# EAGLE design DevBoard (EAGLE 9.3.2)
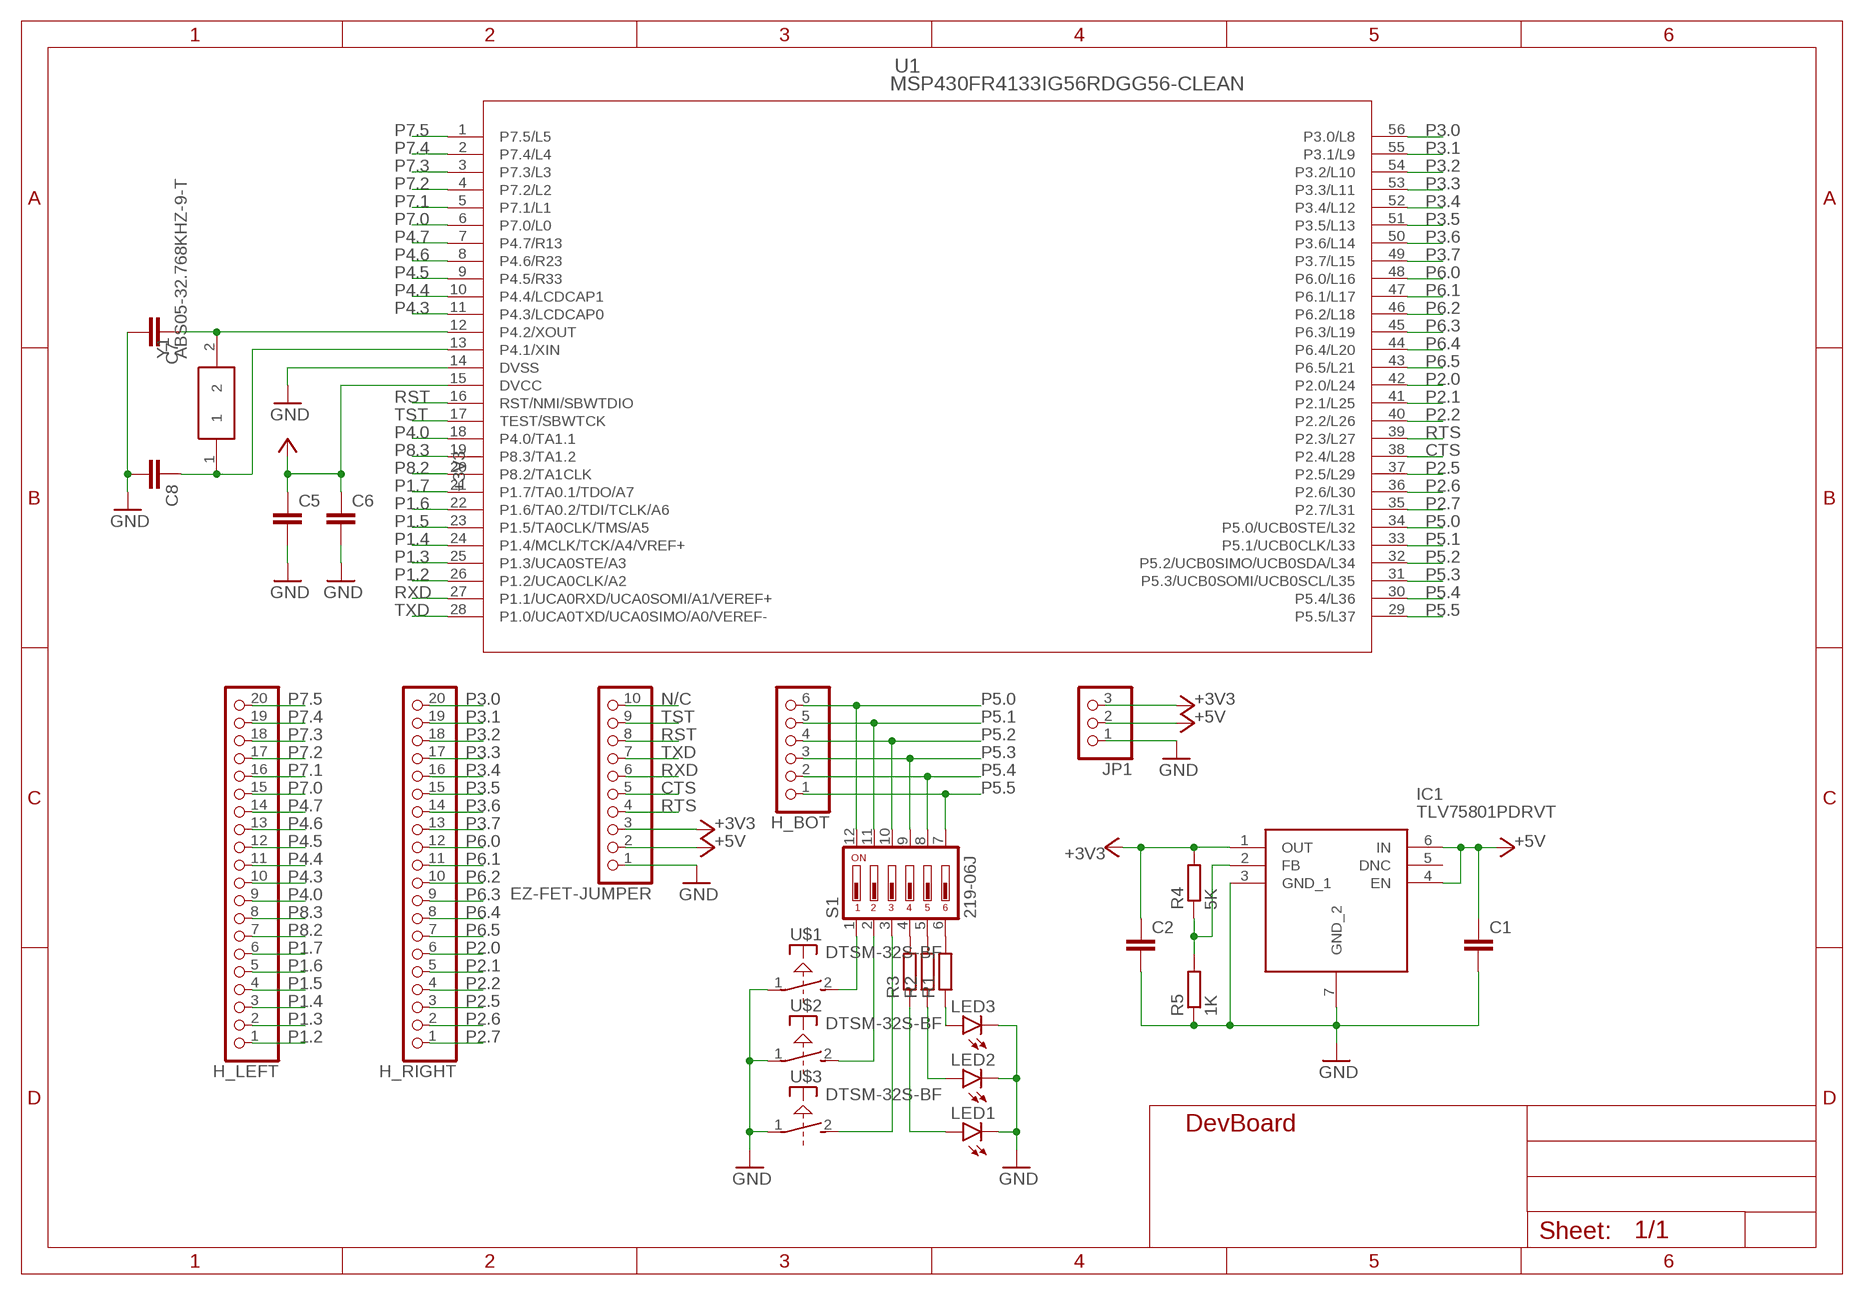
[diagram p0: schematic, sheet 1]

## Parts
C1  C-EUC0805K  [C0805K]
C2  C-EUC0805K  [C0805K]
C5  C-EUC0805K  [C0805K]
C6  C-EUC0805K  [C0805K]
C7  C-EUC0805K  [C0805K]
C8  C-EUC0805K  [C0805K]
EZ-FET-JUMPER  PINHD-1X10  [1X10]
H_BOT  PINHD-1X6  [1X06]
H_LEFT  PINHD-1X20  [1X20]
H_RIGHT  PINHD-1X20  [1X20]
IC1  TLV75801PDRVT  [SON65P200X200X80-7N]
JP1  PINHD-1X3  [1X03]
LED1  LEDCHIP-LED0805  [CHIP-LED0805]
LED2  LEDCHIP-LED0805  [CHIP-LED0805]
LED3  LEDCHIP-LED0805  [CHIP-LED0805]
R1  R-EU_R0805  [R0805]
R2  R-EU_R0805  [R0805]
R3  R-EU_R0805  [R0805]
R4  5K  R-EU_R0805  [R0805]
R5  1K  R-EU_R0805  [R0805]
S1  219-06J  [CTS-219-06J]
U1  MSP430FR4133IG56RDGG56-CLEAN  [DGG56_CLEAN]
U$1  DTSM-32S-BF  [DTSM32SBF]
U$2  DTSM-32S-BF  [DTSM32SBF]
U$3  DTSM-32S-BF  [DTSM32SBF]
Y1  ABS05-32.768KHZ-9-T  [ABS05]

## Nets
+3V3: C2.1 C5.1 C6.1 EZ-FET-JUMPER.3 IC1.1(OUT) JP1.3 R4.2 U1.15(DVCC)
+5V: C1.1 EZ-FET-JUMPER.2 IC1.4(EN) IC1.6(IN) JP1.2
CTS: EZ-FET-JUMPER.5 U1.38(P2.4/L28)
GND: C1.2 C2.2 C5.2 C6.2 C7.2 C8.2 EZ-FET-JUMPER.1 IC1.3(GND_1) IC1.7(GND_2) JP1.1 LED1.C LED2.C LED3.C R5.1 U1.14(DVSS) U$1.1(P) U$2.1(P) U$3.1(P)
N$1: R1.2 S1.6
N$2: R2.2 S1.5
N$3: R3.2 S1.4
N$4: LED1.A R3.1
N$5: LED2.A R2.1
N$6: LED3.A R1.1
N$7: S1.1 U$1.2(S)
N$8: S1.2 U$2.2(S)
N$9: S1.3 U$3.2(S)
N$12: IC1.2(FB) R4.1 R5.2
N$14: C8.1 U1.13(P4.1/XIN) Y1.1
N$16: C7.1 U1.12(P4.2/XOUT) Y1.2
N/C: EZ-FET-JUMPER.10
P1.2: H_LEFT.1 U1.26(P1.2/UCA0CLK/A2)
P1.3: H_LEFT.2 U1.25(P1.3/UCA0STE/A3)
P1.4: H_LEFT.3 U1.24(P1.4/MCLK/TCK/A4/VREF+)
P1.5: H_LEFT.4 U1.23(P1.5/TA0CLK/TMS/A5)
P1.6: H_LEFT.5 U1.22(P1.6/TA0.2/TDI/TCLK/A6)
P1.7: H_LEFT.6 U1.21(P1.7/TA0.1/TDO/A7)
P2.0: H_RIGHT.6 U1.42(P2.0/L24)
P2.1: H_RIGHT.5 U1.41(P2.1/L25)
P2.2: H_RIGHT.4 U1.40(P2.2/L26)
P2.5: H_RIGHT.3 U1.37(P2.5/L29)
P2.6: H_RIGHT.2 U1.36(P2.6/L30)
P2.7: H_RIGHT.1 U1.35(P2.7/L31)
P3.0: H_RIGHT.20 U1.56(P3.0/L8)
P3.1: H_RIGHT.19 U1.55(P3.1/L9)
P3.2: H_RIGHT.18 U1.54(P3.2/L10)
P3.3: H_RIGHT.17 U1.53(P3.3/L11)
P3.4: H_RIGHT.16 U1.52(P3.4/L12)
P3.5: H_RIGHT.15 U1.51(P3.5/L13)
P3.6: H_RIGHT.14 U1.50(P3.6/L14)
P3.7: H_RIGHT.13 U1.49(P3.7/L15)
P4.0: H_LEFT.9 U1.18(P4.0/TA1.1)
P4.3: H_LEFT.10 U1.11(P4.3/LCDCAP0)
P4.4: H_LEFT.11 U1.10(P4.4/LCDCAP1)
P4.5: H_LEFT.12 U1.9(P4.5/R33)
P4.6: H_LEFT.13 U1.8(P4.6/R23)
P4.7: H_LEFT.14 U1.7(P4.7/R13)
P5.0: H_BOT.6 S1.12 U1.34(P5.0/UCB0STE/L32)
P5.1: H_BOT.5 S1.11 U1.33(P5.1/UCB0CLK/L33)
P5.2: H_BOT.4 S1.10 U1.32(P5.2/UCB0SIMO/UCB0SDA/L34)
P5.3: H_BOT.3 S1.9 U1.31(P5.3/UCB0SOMI/UCB0SCL/L35)
P5.4: H_BOT.2 S1.8 U1.30(P5.4/L36)
P5.5: H_BOT.1 S1.7 U1.29(P5.5/L37)
P6.0: H_RIGHT.12 U1.48(P6.0/L16)
P6.1: H_RIGHT.11 U1.47(P6.1/L17)
P6.2: H_RIGHT.10 U1.46(P6.2/L18)
P6.3: H_RIGHT.9 U1.45(P6.3/L19)
P6.4: H_RIGHT.8 U1.44(P6.4/L20)
P6.5: H_RIGHT.7 U1.43(P6.5/L21)
P7.0: H_LEFT.15 U1.6(P7.0/L0)
P7.1: H_LEFT.16 U1.5(P7.1/L1)
P7.2: H_LEFT.17 U1.4(P7.2/L2)
P7.3: H_LEFT.18 U1.3(P7.3/L3)
P7.4: H_LEFT.19 U1.2(P7.4/L4)
P7.5: H_LEFT.20 U1.1(P7.5/L5)
P8.2: H_LEFT.7 U1.20(P8.2/TA1CLK)
P8.3: H_LEFT.8 U1.19(P8.3/TA1.2)
RST: EZ-FET-JUMPER.8 U1.16(RST/NMI/SBWTDIO)
RTS: EZ-FET-JUMPER.4 U1.39(P2.3/L27)
RXD: EZ-FET-JUMPER.6 U1.27(P1.1/UCA0RXD/UCA0SOMI/A1/VEREF+)
TST: EZ-FET-JUMPER.9 U1.17(TEST/SBWTCK)
TXD: EZ-FET-JUMPER.7 U1.28(P1.0/UCA0TXD/UCA0SIMO/A0/VEREF-)
Unconnected: IC1.5(DNC)

## Library data of the parts
C1 C2 C5-C8 = rcl:C-EU: CAPACITOR, European symbol; SPICEPREFIX: C
EZ-FET-JUMPER = pinhead:PINHD-1X10: PIN HEADER
H_BOT = pinhead:PINHD-1X6: PIN HEADER
H_LEFT H_RIGHT = pinhead:PINHD-1X20: PIN HEADER
IC1 = TLV75801PDRVT:TLV75801PDRVT: LDO Voltage Regulators 500MA LDO WITHOUT PG Source: Datasheet <http://www.ti.com/lit/ds/symlink/tlv758p.pdf>; DESCRIPTION: LDO Voltage Regulators 500MA LDO WITHOUT PG; HEIGHT: 0.8mm; MANUFACTURER_NAME: Texas Instruments; MANUFACTURER_PART_NUMBER: TLV75801PDRVT; MOUSER_PART_NUMBER: 595-TLV75801PDRVT; MOUSER_PRICE-STOCK: https://www.mouser.com/Search/Refine.aspx?Keyword=595-TLV75801PDRVT
JP1 = pinhead:PINHD-1X3: PIN HEADER
LED1-LED3 = led:LED: LED OSRAM: - CHIPLED LG R971, LG N971, LY N971, LG Q971, LY Q971, LO R971, LY R971 LH N974, LH R974 LS Q976, LO Q976, LY Q976 LO Q996 - Hyper CHIPLED LW Q18S LB Q993, LB Q99A, LB R99A - SideLED LS A670, LO A670, LY A670, LG A670, LP A670 LB A673, LV A673, LT A673, LW A673 LH A674 LY A675 LS A676, LA A676, LO A676, LY A676, LW A676 LS A679, LY A679, LG A679 - Hyper Micro SIDELED® LS Y876, LA Y876, LO Y876, LY Y876 LT Y87S - SmartLED LW L88C, LW L88S LB L89C, LB L89S, LG L890 LS L89K, LO L89K, LY L89K LS L896, LA L896, LO L896, LY L896 - TOPLED LS T670, LO T670, LY T670, LG T670, LP T670 LSG T670, LSP T670, LSY T670, LOP T670, LYG T670 LG T671, LOG T671, LSG T671 LB T673, LV T673, LT T673, LW T673 LH T674 LS T676, LA T676, LO T676, LY T676, LB T676, LH T676, LSB T676, LW T676 LB T67C, LV T67C, LT T67C, LS T67K, LO T67K, LY T67K, LW E67C LS E67B, LA E67B, LO E67B, LY E67B, LB E67C, LV E67C, LT E67C LW T67C LS T679, LY T679, LG T679 LS T770, LO T770, LY T770, LG T770, LP T770 LB T773, LV T773, LT T773, LW T773 LH T774 LS E675, LA E675, LY E675, LS T675 LS T776, LA T776, LO T776, LY T776, LB T776 LHGB T686 LT T68C, LB T68C - Hyper Mini TOPLED® LB M676 - Mini TOPLED Santana® LG M470 LS M47K, LO M47K, LY M47K Source: http://www.osram.convergy.de LUXEON: - LUMILED® LXK2-PW12-R00, LXK2-PW12-S00, LXK2-PW14-U00, LXK2-PW14-V00 LXK2-PM12-R00, LXK2-PM12-S00, LXK2-PM14-U00 LXK2-PE12-Q00, LXK2-PE12-R00, LXK2-PE12-S00, LXK2-PE14-T00, LXK2-PE14-U00 LXK2-PB12-K00, LXK2-PB12-L00, LXK2-PB12-M00, LXK2-PB14-N00, LXK2-PB14-P00, LXK2-PB14-Q00 LXK2-PR12-L00, LXK2-PR12-M00, LXK2-PR14-Q00, LXK2-PR14-R00 LXK2-PD12-Q00, LXK2-PD12-R00, LXK2-PD12-S00 LXK2-PH12-R00, LXK2-PH12-S00 LXK2-PL12-P00, LXK2-PL12-Q00, LXK2-PL12-R00 Source: www.luxeon.com KINGBRIGHT: KA-3528ASYC Source: www.kingbright.com
R1-R5 = rcl:R-EU_: RESISTOR, European symbol; SPICEPREFIX: R
S1 = switch-dil:219-06*: Surface Mount DIP Switch Series 219 SMT CTS Electronic Components Sourc: www.ctscorp.com; OC_FARNELL: unknown; OC_NEWARK: unknown
U1 = MSP430FR4133IG56R:MSP430FR4133IG56R
U$1-U$3 = DTSM-32S-B:DTSM-32S-BF
Y1 = ABS05-32.768KHZ-9-T:ABS05-32.768KHZ-9-T: Crystals 32.768KHz 9.0pF 20ppm -40C +85C Source: Datasheet <http://www.abracon.com/Resonators/ABS05.pdf>; DESCRIPTION: Crystals 32.768KHz 9.0pF 20ppm -40C +85C; HEIGHT: mm; MANUFACTURER_NAME: ABRACON; MANUFACTURER_PART_NUMBER: ABS05-32.768KHZ-9-T; MOUSER_PART_NUMBER: 815-ABS05-32.768K9T; MOUSER_PRICE-STOCK: https://www.mouser.com/Search/Refine.aspx?Keyword=815-ABS05-32.768K9T; RS_PART_NUMBER: 815-ABS05-32.768K9T; RS_PRICE-STOCK: https://www.mouser.com/Search/Refine.aspx?Keyword=815-ABS05-32.768K9T

## Board
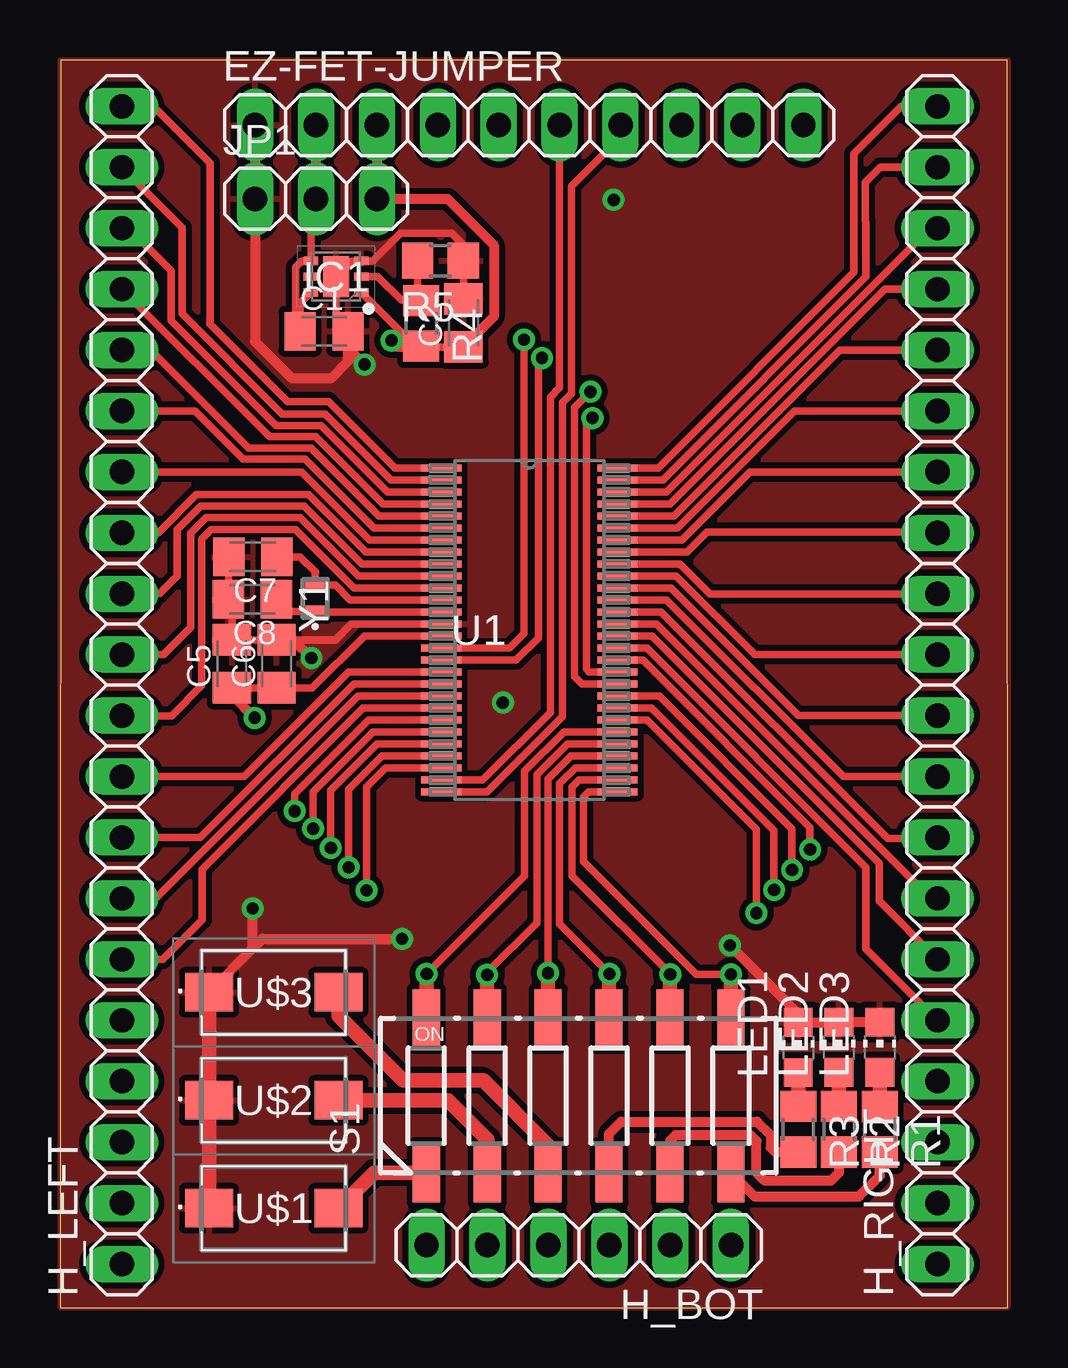
[diagram p1: board, top side]
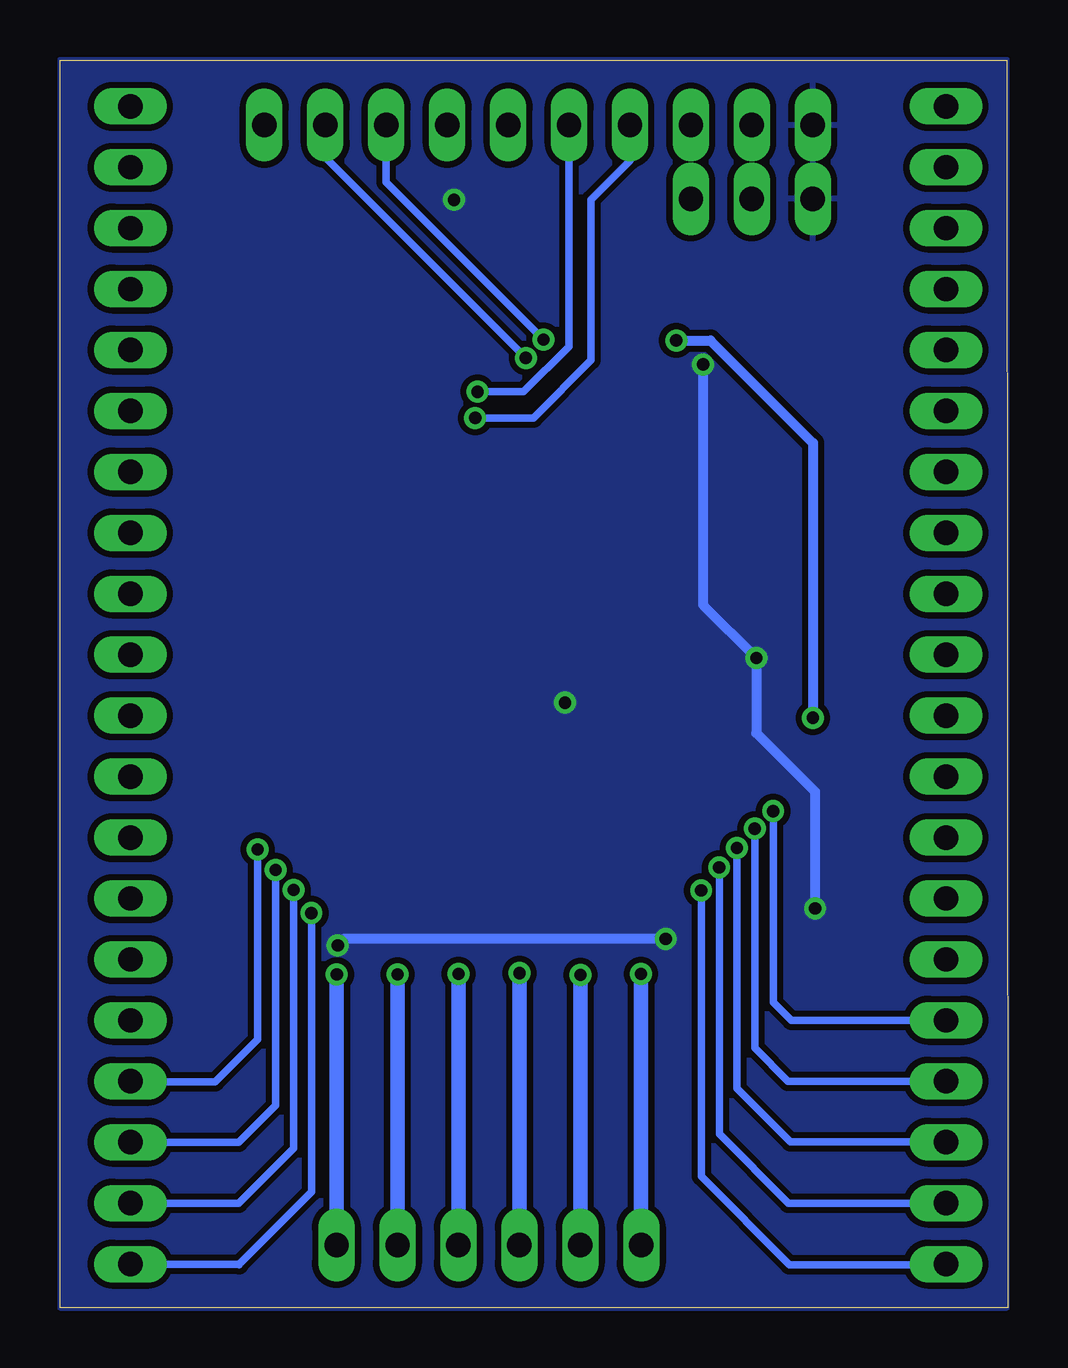
[diagram p2: board, bottom side, seen from below]

Size 39.51 x 52.02 mm. Coordinates in mm from the lower left corner, seen from the top.
Outline: 0,0 39.51,0.02 39.49,52.02 0.04,52.01 0,0
Copper layers (1*16): Top 0.035mm / dielectric 1.5mm / Bottom 0.035mm
Design rules "default *": minimum track width 3.5mil, minimum drill 0.2mm, track to track 6mil, track to pad 5mil, pad to pad 5mil, via to via 5mil, smd to smd 5mil, copper to edge 0mil, drill to drill 6mil, minimum pad ring 10mil, minimum via ring 8mil, stop-mask expansion 4mil, vias tented up to drill 0mil, thermal gap 10mil

### Footprints (pad centres in the part's own frame; a part is rotated, then mirrored left to right if it is on the bottom)
C0805K = smd 1.3 x 1.6: 1 -1,0; 2 1,0
1X10 = drill 1.016 long: 1 -11.43,0; 2 -8.89,0; 3 -6.35,0; 4 -3.81,0; 5 -1.27,0; 6 1.27,0; 7 3.81,0; 8 6.35,0; 9 8.89,0; 10 11.43,0
1X06 = drill 1.016 long: 1 -6.35,0; 2 -3.81,0; 3 -1.27,0; 4 1.27,0; 5 3.81,0; 6 6.35,0
1X20 = drill 1.016 long: 1 -24.13,0; 2 -21.59,0; 3 -19.05,0; 4 -16.51,0; 5 -13.97,0; 6 -11.43,0; 7 -8.89,0; 8 -6.35,0; 9 -3.81,0; 10 -1.27,0; 11 1.27,0; 12 3.81,0; 13 6.35,0; 14 8.89,0; 15 11.43,0; 16 13.97,0; 17 16.51,0; 18 19.05,0; 19 21.59,0; 20 24.13,0
SON65P200X200X80-7N = smd 0.6 x 0.35: 1 -1.05,0.65; 2 -1.05,0; 3 -1.05,-0.65; 4 1.05,-0.65; 5 1.05,0; 6 1.05,0.65 | smd 1.1 x 1.7: 7 0,0
1X03 = drill 1.016 long: 1 -2.54,0; 2 0,0; 3 2.54,0
CHIP-LED0805 = smd 1.2 x 1.2: A 0,-1.05; C 0,1.05
R0805 = smd 1.3 x 1.5: 1 -0.95,0; 2 0.95,0
CTS-219-06J = smd 1.13 x 2.44: 1 -6.35,-3.215; 2 -3.81,-3.215; 3 -1.27,-3.215; 4 1.27,-3.215; 5 3.81,-3.215; 6 6.35,-3.215; 7 6.35,3.215; 8 3.81,3.215; 9 1.27,3.215; 10 -1.27,3.215; 11 -3.81,3.215; 12 -6.35,3.215
DGG56_CLEAN = smd 1.676 x 0.279: 1 -3.67,6.75; 2 -3.67,6.25; 3 -3.67,5.75; 4 -3.67,5.25; 5 -3.67,4.75; 6 -3.67,4.25; 7 -3.67,3.75; 8 -3.67,3.25; 9 -3.67,2.75; 10 -3.67,2.25; 11 -3.67,1.75; 12 -3.67,1.25; 13 -3.67,0.75; 14 -3.67,0.25; 15 -3.67,-0.25; 16 -3.67,-0.75; 17 -3.67,-1.25; 18 -3.67,-1.75; 19 -3.67,-2.25; 20 -3.67,-2.75; 21 -3.67,-3.25; 22 -3.67,-3.75; 23 -3.67,-4.25; 24 -3.67,-4.75; 25 -3.67,-5.25; 26 -3.67,-5.75; 27 -3.67,-6.25; 28 -3.67,-6.75; 29 3.67,-6.75; 30 3.67,-6.25; 31 3.67,-5.75; 32 3.67,-5.25; 33 3.67,-4.75; 34 3.67,-4.25; 35 3.67,-3.75; 36 3.67,-3.25; 37 3.67,-2.75; 38 3.67,-2.25; 39 3.67,-1.75; 40 3.67,-1.25; 41 3.67,-0.75; 42 3.67,-0.25; 43 3.67,0.25; 44 3.67,0.75; 45 3.67,1.25; 46 3.67,1.75; 47 3.67,2.25; 48 3.67,2.75; 49 3.67,3.25; 50 3.67,3.75; 51 3.67,4.25; 52 3.67,4.75; 53 3.67,5.25; 54 3.67,5.75; 55 3.67,6.25; 56 3.67,6.75
DTSM32SBF = smd 2 x 1.6: 1 -2.7,0; 2 2.7,0
ABS05 = smd 0.5 x 1: 1 -0.55,0; 2 0.55,0

### Placement (x,y rotation side)
C1  11.01,40.71 0 top
C2  16.82,41.06 90 top
C5  7.17,26.85 90 top
C6  9.03,26.85 90 top
C7  8.04,31.31 180 top
C8  8.02,29.54 180 top
EZ-FET-JUMPER  19.56,49.31 0 top
H_BOT  21.63,2.62 180 top
H_LEFT  2.58,25.96 90 top
H_RIGHT  36.58,25.96 90 top
IC1  11.51,42.99 180 top
JP1  10.67,46.23 0 top
LED1  30.77,10.86 0 top
LED2  32.47,10.87 0 top
LED3  34.17,10.87 0 top
R1  34.17,7.45 270 top
R2  32.47,7.45 270 top
R3  30.77,7.45 270 top
R4  15.06,41.04 270 top
R5  15.86,43.65 180 top
S1  21.62,8.85 0 top
U1  19.57,28.26 0 top
U$1  8.91,4.16 0 top
U$2  8.91,8.66 0 top
U$3  8.91,13.16 0 top
U$4  [METRIC_15]  0,0 90 top
U$5  [METRIC_15]  0,0 180 bottom
U$6  [METRIC_15]  39.5,0.02 90 bottom
Y1  10.64,29.58 90 top

### Tracks (layer width: path | path; a pad name or v marks a point on that pad's centre or on a via)
+3V3  (via drill 0.51)
  Top 0.305: IC1.1 14.81,40.09 R4.2 15.09,40.06 C2.1 | U1.15 12.69,28.02 10.52,25.85 C6.1 C5.1
  Top 0.406: C5.1 7.17,25.55 v8.12,24.6 | C2.1 18.09,41.33 18.09,44.3 16.16,46.23 JP1.3 EZ-FET-JUMPER.3 | 15.09,40.06 14.09,40.06 v13.82,40.33
  Bottom 0.406: v13.82,40.33 12.39,40.33 8.12,36.06 v8.12,24.6
+5V
  Top 0.305: JP1.2 10.46,46.02 IC1.4 10.07,43.64 9.82,43.39 9.82,41.41 10.01,41.22 | IC1.6 10.01,41.89 10.01,41.22 | 10.01,41.22 C1.1
  Top 0.406: JP1.2 EZ-FET-JUMPER.2
CTS  (via drill 0.51)
  Top 0.305: U1.38 21.76,26.01 21.45,26.32 21.45,37.53 v22.11,38.19
  Bottom 0.305: v22.11,38.19 20.18,38.19 18.29,40.08 EZ-FET-JUMPER.5
GND  (via drill 0.51)
  Top 0.305: C1.2 11.51,41.21 IC1.7 12.16,43.64 IC1.3 13.03,43.64 14.2,44.81 16.33,44.81 16.81,44.33 R5.1 C2.2 | 6.21,5.05 5.97,4.81 5.97,4.4 U$1.1 | C7.2 7.04,29.56 C8.2 7.17,29.39 C5.2 C6.2 11.48,27.85 12.14,28.51 U1.14
  Top 0.406: C6.2 9.72,27.85 v10.48,27.09 | EZ-FET-JUMPER.1 JP1.1 8.13,40.29 9.65,38.77 11.32,38.77 12.04,39.49 12.01,39.52 C1.2 12.01,40.02 v12.7,39.33 | LED3.C LED2.C LED1.C 30.77,12.27 v27.93,15.11 | U$3.1 8.03,14.98 | 8.03,14.98 v8.03,16.66 | 8.03,14.98 8.44,15.39 v14.26,15.39
  Top 0.61: U$3.1 U$2.1 6.21,4.64 5.97,4.4
  Bottom 0.406: v8.03,16.66 8.03,21.51 10.48,23.96 v10.48,27.09 12.7,29.31 v12.7,39.33 | v14.26,15.39 27.65,15.39 v27.93,15.11
  other vias: 23.08,46.19 18.46,25.23
  pour Top (isolate 0.254): 0.04,52.01 39.5,52.01 39.5,0.02 0.04,0.02
  pour Bottom (isolate 0.254): 0.04,52.01 39.5,52.01 39.5,0.02 0.04,0.02
N$1
  Top 0.406: S1.6 28.95,4.65 33.31,4.65 34.18,5.52 34.17,5.53 R1.2
N$2
  Top 0.406: R2.2 32.47,5.64 32.14,5.31 29.37,5.31 29.04,5.64 29.04,6.96 28.8,7.2 25.66,7.2 25.43,6.97 S1.5
N$3
  Top 0.406: S1.4 22.89,7.26 23.39,7.76 29.06,7.76 29.63,7.19 29.63,6.68 29.8,6.51 R3.2
N$4
  Top 0.61: LED1.A R3.1
N$5
  Top 0.61: LED2.A R2.1
N$6
  Top 0.61: LED3.A R1.1
N$7
  Top 0.305: 11.05,4.09 11.12,4.16 U$1.2
  Top 0.61: S1.1 13.08,5.63 U$1.2
N$8
  Top 0.61: U$2.2 16.18,8.66 17.83,7.01 17.81,6.99 S1.2
N$9
  Top 0.305: 11.61,12.75 U$3.2
  Top 0.61: S1.3 20.35,6.78 17.65,9.48 14.3,9.48 11.61,12.17 U$3.2
N$12
  Top 0.305: IC1.2 13.24,42.99 14.23,42 15.01,42 | 15.01,42 R4.1 | R5.2 14.91,42.1 15.01,42
N$14
  Top 0.305: U1.13 10.66,29.01 Y1.1 9.53,29.03 C8.1
N$16
  Top 0.305: U1.12 12.1,29.51 11.48,30.13 Y1.2 10.64,30.67 10.65,30.68 10.02,31.31 C7.1
P1.2  (via drill 0.51)
  Top 0.305: U1.26 13.58,22.51 12.78,21.71 v12.78,17.4
  Bottom 0.305: v12.78,17.4 12.78,5.48 9.1,1.8 2.61,1.8 H_LEFT.1
P1.3  (via drill 0.51)
  Top 0.305: U1.25 13.43,23.01 12.03,21.61 v12.03,18.37
  Bottom 0.305: v12.03,18.37 12.03,7.26 9.14,4.37 H_LEFT.2
P1.4  (via drill 0.51)
  Top 0.305: U1.24 13.22,23.51 11.29,21.58 v11.29,19.18
  Bottom 0.305: v11.29,19.18 11.29,9.15 9.06,6.92 H_LEFT.3
P1.5  (via drill 0.51)
  Top 0.305: U1.23 13.05,24.01 10.55,21.51 v10.55,19.98
  Bottom 0.305: v10.55,19.98 10.55,10.84 9.16,9.45 H_LEFT.4
P1.6  (via drill 0.51)
  Top 0.305: U1.22 12.86,24.51 9.78,21.43 v9.78,20.71
  Bottom 0.305: v9.78,20.71 9.78,12.74 9.03,11.99 H_LEFT.5
P1.7
  Top 0.305: U1.21 12.64,25.01 5.92,18.29 5.92,16.17 4.28,14.53 H_LEFT.6
P2.0
  Top 0.305: U1.42 24.67,28.01 34.15,18.53 34.15,16.96 H_RIGHT.6
P2.1
  Top 0.305: U1.41 24.46,27.51 33.6,18.37 33.6,14.97 H_RIGHT.5
P2.2  (via drill 0.51)
  Top 0.305: U1.40 24.3,27.01 31.27,20.04 v31.27,19.12
  Bottom 0.305: H_RIGHT.4 36.55,9.42 33.04,9.42 31.27,11.19 v31.27,19.12
P2.5  (via drill 0.51)
  Top 0.305: U1.37 24.98,25.51 30.52,19.97 v30.52,18.26
  Bottom 0.305: H_RIGHT.3 32.06,6.91 30.52,8.45 v30.52,18.26
P2.6  (via drill 0.51)
  Top 0.305: U1.36 24.66,25.01 29.77,19.9 v29.77,17.43
  Bottom 0.305: H_RIGHT.2 32.06,4.37 29.77,6.66 v29.77,17.43
P2.7  (via drill 0.51)
  Top 0.305: U1.35 24.47,24.51 29.03,19.95 v29.03,16.46
  Bottom 0.305: H_RIGHT.1 32.05,1.83 | 32.05,1.83 32.05,1.81 | 29.03,16.58 v29.03,16.46 29.03,4.85 32.05,1.83
P3.0
  Top 0.305: U1.56 24.94,35.01 33.1,43.17 33.1,48.12 35.07,50.09 H_RIGHT.20
P3.1
  Top 0.305: U1.55 25.13,34.51 33.6,42.98 33.6,45.28 33.58,45.3 33.58,46.93 34.2,47.55 H_RIGHT.19
P3.2
  Top 0.305: U1.54 25.28,34.01 36.28,45.01 H_RIGHT.18
P3.3
  Top 0.305: U1.53 25.43,33.51 34.39,42.47 H_RIGHT.17
P3.4
  Top 0.305: U1.52 25.59,33.01 32.51,39.93 H_RIGHT.16
P3.5
  Top 0.305: U1.51 25.74,32.51 30.62,37.39 H_RIGHT.15
P3.6
  Top 0.305: U1.50 25.92,32.01 28.76,34.85 H_RIGHT.14
P3.7
  Top 0.305: U1.49 26.13,31.51 26.96,32.34 36.55,32.34 H_RIGHT.13
P4.0
  Top 0.305: U1.18 12.04,26.51 7.68,22.15 H_LEFT.9
P4.3
  Top 0.305: H_LEFT.10 4.65,24.68 5.91,25.94 5.91,32.06 6.3,32.45 9.83,32.45 12.27,30.01 U1.11
P4.4
  Top 0.305: U1.10 12.44,30.51 10,32.95 6.09,32.95 5.45,32.31 5.45,28.36 4.33,27.24 H_LEFT.11
P4.5
  Top 0.305: U1.9 12.6,31.01 10.18,33.43 5.87,33.43 4.89,32.45 4.89,30.52 4.15,29.78 H_LEFT.12
P4.6
  Top 0.305: U1.8 12.76,31.51 10.37,33.9 5.68,33.9 4.09,32.31 H_LEFT.13
P4.7
  Top 0.305: U1.7 12.91,32.01 10.07,34.85 H_LEFT.14
P5.0  (via drill 0.51)
  Top 0.305: 15.31,12.11 S1.12 | U1.34 21,24.01 19.37,22.38 19.37,18 v15.29,13.92
  Top 0.61: v15.29,13.92 15.29,12.12 15.31,12.11
  Bottom 0.61: 15.32,13.84 15.29,13.87 v15.29,13.92 H_BOT.6
P5.1  (via drill 0.51)
  Top 0.305: U1.33 21.15,23.51 19.88,22.24 19.88,16.06 17.81,13.99 v17.81,13.88
  Top 0.61: v17.81,13.88 S1.11
  Bottom 0.61: H_BOT.5 v17.82,13.87 v17.81,13.88
P5.2  (via drill 0.51)
  Top 0.305: v20.35,13.96 20.35,22.05 21.31,23.01 U1.32
  Top 0.61: S1.10 v20.35,13.96
  Bottom 0.61: v20.35,13.96 H_BOT.4
P5.3  (via drill 0.51)
  Top 0.305: v22.9,13.93 20.83,16 20.83,21.86 21.48,22.51 U1.31
  Top 0.61: S1.9 v22.89,13.93 v22.9,13.93
  Bottom 0.61: v22.9,13.93 H_BOT.3
P5.4  (via drill 0.51)
  Top 0.305: v25.43,13.91 v25.44,13.92 21.34,18.02 21.34,21.72 21.63,22.01 U1.30
  Top 0.61: S1.8 v25.43,13.91 v25.44,13.91
  Bottom 0.61: H_BOT.2 v25.44,13.91
P5.5  (via drill 0.51)
  Top 0.305: v27.97,13.9 26.54,13.9 21.82,18.62 21.82,21.3 22.03,21.51 U1.29
  Top 0.61: S1.7 v27.97,13.9
  Bottom 0.61: v27.97,13.9 H_BOT.1
P6.0
  Top 0.305: U1.48 25.85,31.01 27.1,29.76 H_RIGHT.12
P6.1
  Top 0.305: U1.47 25.68,30.51 28.96,27.23 H_RIGHT.11
P6.2
  Top 0.305: U1.46 25.47,30.01 30.79,24.69 H_RIGHT.10
P6.3
  Top 0.305: U1.45 25.29,29.51 32.65,22.15 H_RIGHT.9
P6.4
  Top 0.305: U1.44 25.06,29.01 34.5,19.57 36.54,19.57 H_RIGHT.8
P6.5
  Top 0.305: U1.43 24.86,28.51 36.3,17.07 H_RIGHT.7
P7.0
  Top 0.305: U1.6 13.1,32.51 10.22,35.39 7.64,35.39 5.64,37.39 H_LEFT.15
P7.1
  Top 0.305: U1.5 13.3,33.01 10.46,35.85 7.86,35.85 3.78,39.93 H_LEFT.16
P7.2
  Top 0.305: U1.4 13.46,33.51 10.65,36.32 8.73,36.32 H_LEFT.17
P7.3
  Top 0.305: U1.3 13.66,34.01 10.89,36.78 9,36.78 4.63,41.15 4.63,43.24 2.86,45.01 H_LEFT.18
P7.4
  Top 0.305: U1.2 13.81,34.51 11.05,37.27 9.26,37.27 5.09,41.44 5.09,45.04 H_LEFT.19
P7.5
  Top 0.305: H_LEFT.20 3.89,50.09 6.27,47.71 6.27,41.06 6.24,41.03 9.48,37.79 11.19,37.79 13.97,35.01 U1.1
P8.2
  Top 0.305: U1.20 12.42,25.51 3.98,17.07 H_LEFT.7
P8.3
  Top 0.305: U1.19 12.25,26.01 5.85,19.61 H_LEFT.8
RST  (via drill 0.51)
  Top 0.305: U1.16 18.74,27.51 19.35,28.12 v19.35,40.37
  Bottom 0.305: v19.35,40.37 25.91,46.93 EZ-FET-JUMPER.8
RTS  (via drill 0.51)
  Top 0.305: U1.39 22.06,26.51 21.94,26.63 21.94,36.84 v22.2,37.1
  Bottom 0.305: EZ-FET-JUMPER.4 15.75,47.83 17.38,46.2 17.38,39.5 19.78,37.1 v22.2,37.1
RXD
  Top 0.305: U1.27 17.62,22 20.44,24.82 20.44,37.97 20.83,38.36 EZ-FET-JUMPER.6
TST  (via drill 0.51)
  Top 0.305: U1.17 19.02,27.01 19.94,27.93 19.94,39.45 v20.09,39.6
  Bottom 0.305: v20.09,39.6 28.45,47.96 EZ-FET-JUMPER.9
TXD
  Top 0.305: U1.28 17.8,21.51 20.94,24.65 20.94,37.73 21.33,38.12 21.33,46.77 23.37,48.81 EZ-FET-JUMPER.7